# Altium schematic sheet energy_router_control_plane.SchDoc
size A4
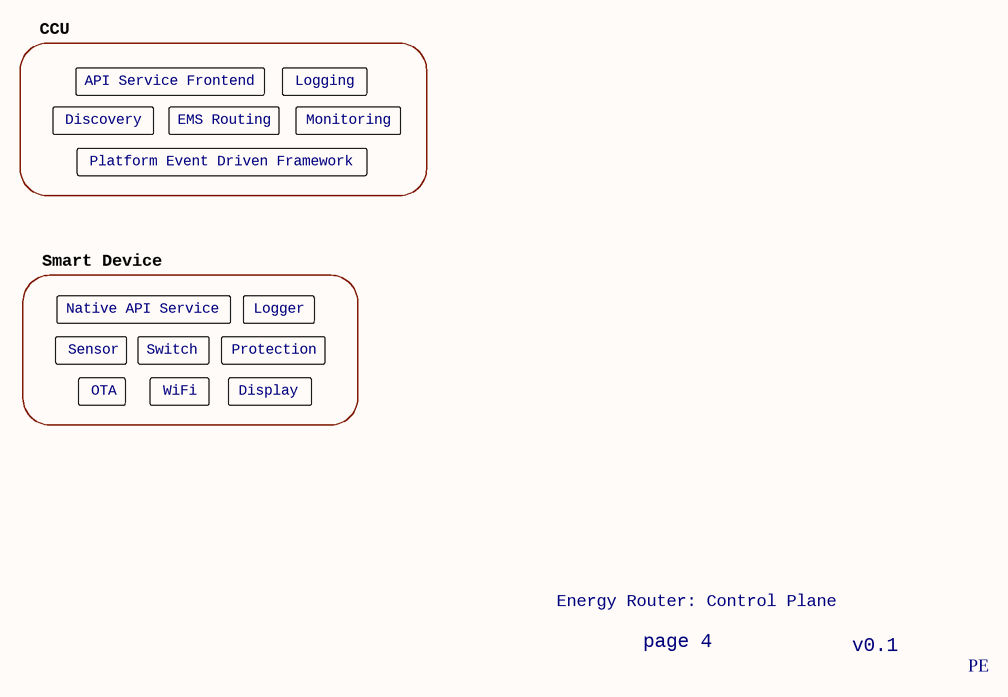
[diagram p0: energy_router_control_plane.SchDoc]

## Notes on the sheet
- CCU
- Discovery
- API Service Frontend
- EMS Routing
- Logging
- Monitoring
- Platform Event Driven Framework
- Smart Device
- Native API Service
- Logger
- Sensor
- OTA
- Switch
- WiFi
- Protection
- Display
- Energy Router: Control Plane
- page 4
- v0.1
- PE